# EAGLE schematic batterieChargeur (EAGLE 7.6.0)
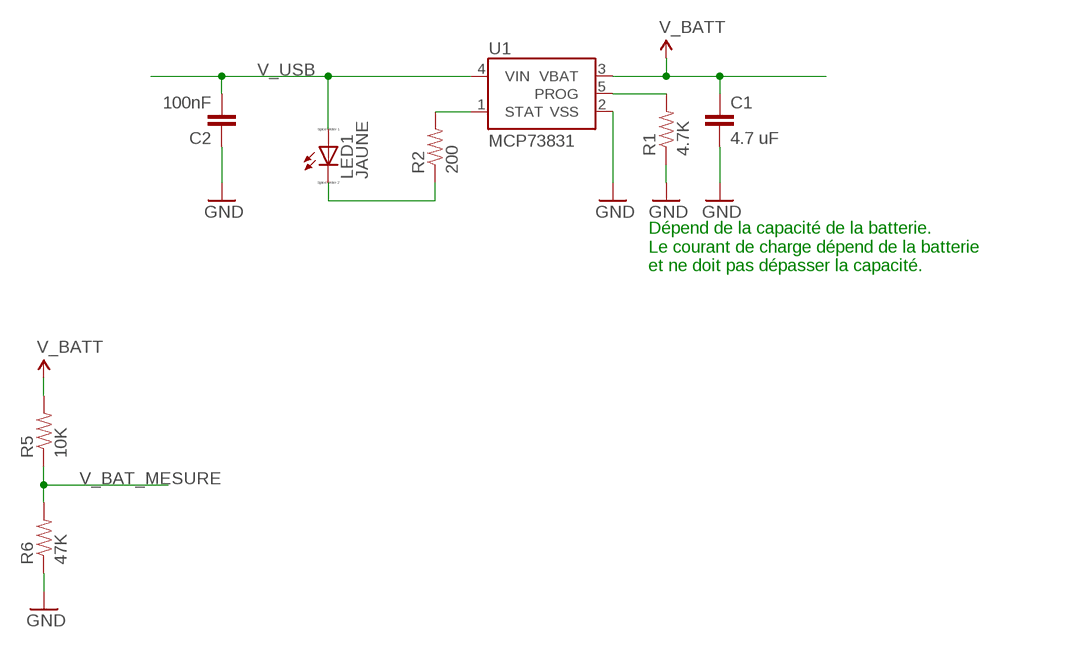
[diagram p0: schematic, sheet 1]

## Parts
C1  4.7 uF  CAP0805  [0805]
C2  100nF  CAP0805  [0805]
LED1  JAUNE  LED_E  [LED_1206]
R1  4.7K  RESISTOR0805-RES  [0805]
R2  200  RESISTOR0805-RES  [0805]
R5  10K  RESISTOR0805-RES  [0805]
R6  47K  RESISTOR0805-RES  [0805]
U1  MCP73831  [SOT23-5]

## Nets
GND: C1.2 C2.1 R1.1 R6.1 U1.2(VSS)
N$1: LED1.C R2.1
N$2: R1.2 U1.5(PROG)
N$4: R2.2 U1.1(STAT)
V_BAT_MESURE: R5.1 R6.2
V_BATT [SUPPLY]: C1.1 R5.2 U1.3(VBAT)
V_USB [SUPPLY]: C2.2 LED1.A U1.4(VIN)

## Notes on the sheet
- Dépend de la capacité de la batterie. 
  Le courant de charge dépend de la batterie 
  et ne doit pas dépasser la capacité.

## Library data of the parts
C1 = SparkFun-Capacitors:CAP: Capacitor Standard 0603 ceramic capacitor, and 0.1" leaded capacitor.
C2 = SparkFun-Passives:CAP: Capacitor Standard 0603 ceramic capacitor, and 0.1" leaded capacitor.
LED1 = eagle-ltspice:LED_E: LED Source: http://www.osram.convergy.de Source: www.luxeon.com Source: www.kingbright.com; SPICEMODEL: NONE; SPICEPREFIX: D; SPICETYPE: diode
R1 R2 R5 R6 = SparkFun-Passives:RESISTOR: Resistor Basic schematic elements and footprints for 0603, 1206, and PTH resistors.
U1 = SparkFun-PowerIC:MCP73831: Miniature single cell, fully integrated Li-Ion, Li-polymer charge management controller http://ww1.microchip.com/downloads/en/DeviceDoc/20001984g.pdf IC-09995; PROD_ID: IC-09995

## Net classes
1 SUPPLY: width 0.5 mm, drill 0.2 mm, clearance 0.5 mm